# Altium schematic sheet ESP32S3.SchDoc
size A3; SheetNumber: 1; SheetTotal: 1
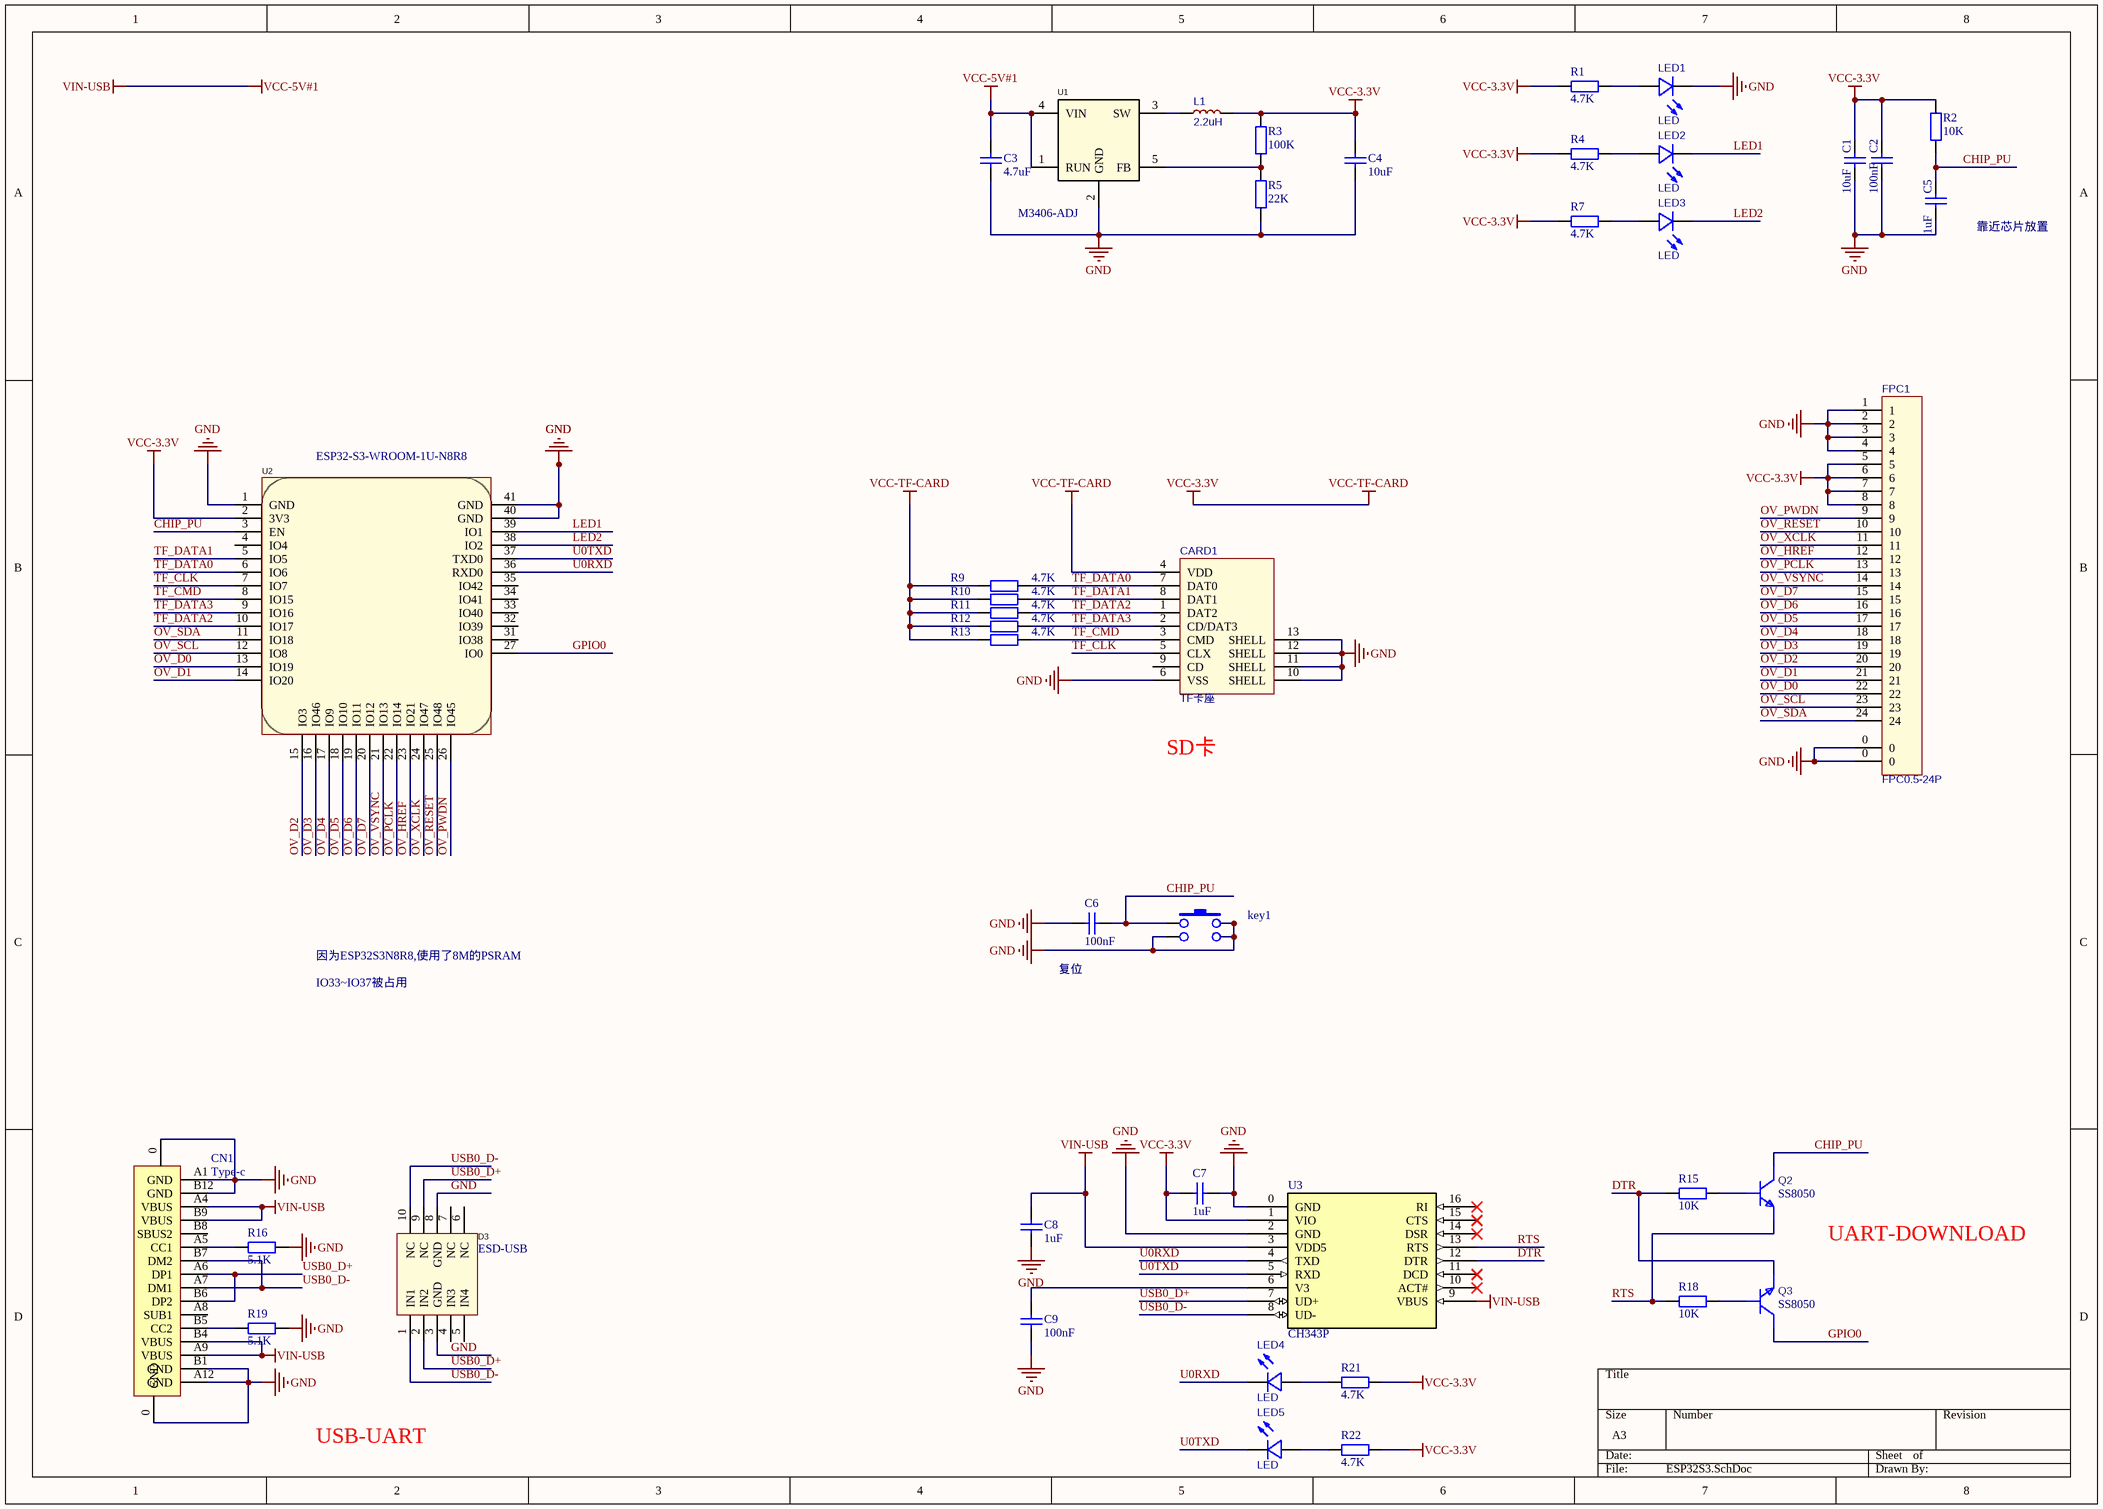
[diagram p0: ESP32S3.SchDoc]

## Parts
C1  10uF  [0603-C]
C2  100nF  [0603-C]
C3  4.7uF  [0603-C]
C4  10uF  [0603-C]
C5  1uF  [0603-C]
C6  100nF  [0603-C]
C7  1uF  [0603-C]
C8  1uF  [0603-C]
C9  100nF  [0603-C]
CARD1  TF卡座  [TF]
CN1  Type-c  [Type-c 16pin]
D3  ESD-USB  [SLP2510P8]
FPC1  FPC0.5-24P  [FPC-SMD_P0.50-24P_XJ-FGS]
key1  KEY  [轻触开关侧按3*6*3.5]  (value not drawn)
L1  2.2uH  [电感 4.2X4.4]
LED1  LED  [LED-0603]
LED2  LED  [LED-0603]
LED3  LED  [LED-0603]
LED4  LED  [LED-0603]
LED5  LED  [LED-0603]
Q2  SS8050  [SOT23-3M]
Q3  SS8050  [SOT23-3M]
R1  4.7K  [0603-R]
R2  10K  [0603-R]
R3  100K  [0603-R]
R4  4.7K  [0603-R]
R5  22K  [0603-R]
R7  4.7K  [0603-R]
R9  4.7K  [0603-R]
R10  4.7K  [0603-R]
R11  4.7K  [0603-R]
R12  4.7K  [0603-R]
R13  4.7K  [0603-R]
R15  10K  [0603-R]
R16  5.1K  [0603-R]
R18  10K  [0603-R]
R19  5.1K  [0603-R]
R21  4.7K  [0603-R]
R22  4.7K  [0603-R]
U1  M3406-ADJ  [M3406-ADJ]
U2  ESP32-S3-WROOM-1U-N8R8  [WIRELM-SMD_ESP32-S3-WROOM-1U]
U3  CH343P  [QFN16_3X3]

## Nets
GND: C1.1 C2.2 C3.1 C4.1 C5.2 C6.2 C7.2 C8.2 C9.2 CARD1.6(VSS) CARD1.10(SHELL) CARD1.11(SHELL) CARD1.12(SHELL) CARD1.13(SHELL) CN1.0(GND) CN1.A1(GND) CN1.A12(GND) CN1.B1(GND) CN1.B12(GND) D3.3(GND) D3.8(GND) FPC1.0 FPC1.1 FPC1.2 FPC1.3 FPC1.4 key1.2 key1.3 key1.4 LED1.1(-) R5.2 R16.2 R19.2 U1.2(GND) U2.1(GND) U2.40(GND) U2.41(GND) U3.0(GND) U3.2(GND)
VCC-3.3V: C1.2 C2.1 C4.2 C7.1 CARD1.4(VDD) FPC1.5 FPC1.6 FPC1.7 FPC1.8 L1.2 R1.1 R2.2 R3.2 R4.1 R7.1 R9.1 R10.1 R11.1 R12.1 R13.1 R21.1 R22.1 U2.2(3V3) U3.1(VIO)  [also labelled VCC-TF-CARD]
VCC-5V#1: C3.2 C8.1 CN1.A4(VBUS) CN1.A9(VBUS) CN1.B4(VBUS) CN1.B9(VBUS) U1.1(RUN) U1.4(VIN) U3.3(VDD5) U3.9(VBUS)  [also labelled VIN-USB]
CHIP_PU: C5.1 C6.1 key1.1 Q2.3(C) R2.1 U2.3(EN)
DTR: Q3.2(E) R15.1 U3.12(DTR)
GPIO0: Q3.3(C) U2.27(IO0)
LED1: LED2.1(-) U2.39(IO1)
LED2: LED3.1(-) U2.38(IO2)
OV_D0: FPC1.22 U2.13(IO19)
OV_D1: FPC1.21 U2.14(IO20)
OV_D2: FPC1.20 U2.15(IO3)
OV_D3: FPC1.19 U2.16(IO46)
OV_D4: FPC1.18 U2.17(IO9)
OV_D5: FPC1.17 U2.18(IO10)
OV_D6: FPC1.16 U2.19(IO11)
OV_D7: FPC1.15 U2.20(IO12)
OV_HREF: FPC1.12 U2.23(IO21)
OV_PCLK: FPC1.13 U2.22(IO14)
OV_PWDN: FPC1.9 U2.26(IO45)
OV_RESET: FPC1.10 U2.25(IO48)
OV_SCL: FPC1.23 U2.12(IO8)
OV_SDA: FPC1.24 U2.11(IO18)
OV_VSYNC: FPC1.14 U2.21(IO13)
OV_XCLK: FPC1.11 U2.24(IO47)
RTS: Q2.2(E) R18.1 U3.13(RTS)
TF_CLK: CARD1.5(CLX) U2.7(IO7)
TF_CMD: CARD1.3(CMD) R13.2 U2.8(IO15)
TF_DATA0: CARD1.7(DAT0) R9.2 U2.6(IO6)
TF_DATA1: CARD1.8(DAT1) R10.2 U2.5(IO5)
TF_DATA2: CARD1.1(DAT2) R11.2 U2.10(IO17)
TF_DATA3: CARD1.2(CD/DAT3) R12.2 U2.9(IO16)
U0RXD: LED4.1(-) U2.36(RXD0) U3.4(TXD)
U0TXD: LED5.1(-) U2.37(TXD0) U3.5(RXD)
USB0_D+: CN1.A6(DP1) CN1.B6(DP2) D3.2(IN2) D3.9(NC) U3.7(UD+)
USB0_D-: CN1.A7(DM1) CN1.B7(DM2) D3.1(IN1) D3.10(NC) U3.8(UD-)
NetC9_1: C9.1 U3.6(V3)
NetCN1_A5: CN1.A5(CC1) R16.1
NetCN1_B5: CN1.B5(CC2) R19.1
NetL1_1: L1.1 U1.3(SW)
NetLED1_2: LED1.2(+) R1.2
NetLED2_2: LED2.2(+) R4.2
NetLED3_2: LED3.2(+) R7.2
NetLED4_2: LED4.2(+) R21.2
NetLED5_2: LED5.2(+) R22.2
NetQ2_1: Q2.1(B) R15.2
NetQ3_1: Q3.1(B) R18.2
NetR3_1: R3.1 R5.1 U1.5(FB)

Not connected (* = marked no-connect by the designer): CARD1 9(CD); CN1 A8(SUB1) B8(SBUS2); D3 4(IN3) 5(IN4) 6(NC) 7(NC); U2 4(IO4) 31(IO38) 32(IO39) 33(IO40) 34(IO41) 35(IO42); U3 10(ACT#)* 11(DCD)* 14(DSR)* 15(CTS)* 16(RI)*

## Notes on the sheet
- (near C5) 靠近芯片放置
- SD卡
- 因为ESP32S3N8R8,使用了8M的PSRAM
- IO33~IO37被占用
- (near C6) 复位
- UART-DOWNLOAD
- USB-UART

## Library data of the parts
C1-C9 = C: 贴片电容; BOM名称: 无极性贴片电容; 联系卖家，免费查找封装: 唯一出售店铺网址https://shop463601444.taobao.com
CARD1 = TF卡座: BOM_Manufacturer: THD; BOM_Manufacturer Part: THD2528-11SD-GF; Contributor: LCSC; BOM_Supplier: LCSC; BOM_Supplier Part: C283232; BOM_JLCPCB Part Class: Extended Part; spicePre: C; spiceSymbolName: THD2528-11SD-GF
CN1 = Type-c: U262-161N-4BVC11
D3 = ESD-USB: RClamp0524PATCT; Manufacturer: SEMTECH; Device: RClamp0524PATCT_C40960; Add into BOM: yes; Reverse Stand-Off Voltage (Vrwm): 5V; Breakdown Voltage (VBR): 6V; Clamping Voltage@Ipp: 15V; Peak Pulse Power(Ppp)@8/20us: 150W; Junction Capacitance(Cj)@1MHz: 0.8pF@1MHz; Name: RClamp0524PATCT; Symbol: RClamp0524PATCT; LCSC Part Name: RClamp0524PATCT; Supplier Part: C40960; Manufacturer Part: RClamp0524PATCT; Supplier Footprint: SLP2510P8; JLCPCB Part Class: Extended Part; Datasheet: https://atta.szlcsc.com/upload/public/pdf/source/20150124/1457707260739.pdf; Supplier: LCSC; Convert to PCB: yes; Operating Temperature: -55℃~+125℃@(Tj)
FPC1 = FPC0.5-24P: BOM_Manufacturer: Shenzhen Cankemeng; Contributor: LCSC; BOM_Supplier: LCSC; BOM_Supplier Part: C132514; BOM_Manufacturer Part: -; BOM_JLCPCB Part Class: Extended Part; spicePre: F; spiceSymbolName: FPC0.5-24P
key1 = 轻触开关3*6*3.6
L1 = L: BOM_Manufacturer: Sunlord; BOM_Manufacturer Part: UPZ2012D800-4R0TF; nameAlias: Value; Contributor: LCSC; BOM_Supplier: LCSC; BOM_Supplier Part: C145060; BOM_JLCPCB Part Class: Extended Part; spicePre: L; spiceSymbolName: UPZ2012D800-4R0TF
LED1-LED5 = LED: BOM_Manufacturer: Wuxi ARK Tech Elec; BOM_Manufacturer Part: D-G060306G1-KS2; Contributor: LCSC; BOM_Supplier: LCSC; BOM_Supplier Part: C118334; BOM_JLCPCB Part Class: Extended Part; spicePre: L; spiceSymbolName: D-G060306G1-KS2
R1-R5 R7 R9-R13 R15 R16 R18 R19 R21 R22 = R: 贴片电阻; 联系卖家，免费查找封装: 唯一出售店铺网址https://shop463601444.taobao.com; BOM名称: 贴片电阻
U1 = M3406-ADJ: Manufacturer: 西安航天民芯; Symbol: M3406; Add into BOM: yes; Function: 降压型; Name: M3406-ADJ; Device: M3406-ADJ; LCSC Part Name: 降压型; Supplier Part: C83224; Manufacturer Part: M3406-ADJ; Supplier Footprint: SOT-23-5; JLCPCB Part Class: Extended Part; Datasheet: https://atta.szlcsc.com/upload/public/pdf/source/20161110/1478742836232.pdf; Supplier: LCSC; Convert to PCB: yes; Synchronous Rectification: -; Number of Outputs: -; Topology: -; Input Voltage: -; Output Current (Max): -; Switching Frequency: -
U2 = ESP32-S3-WROOM-1U-N8R8: Manufacturer: ESPRESSIF(乐鑫); Add into BOM: yes; Name: ESP32-S3-WROOM-1U-N8; Symbol: ESP32-S3-WROOM-1U-N8; Device: ESP32-S3-WROOM-1U-N8; LCSC Part Name: ESP32-S3-WROOM-1U-N8; Supplier Part: C2980297; Manufacturer Part: ESP32-S3-WROOM-1U-N8; Supplier Footprint: SMD; JLCPCB Part Class: Extended Part; Datasheet: https://atta.szlcsc.com/upload/public/pdf/source/20220628/A2AC12B3C87735CAEB7EBE2DBE80936C.pdf; Supplier: LCSC; Convert to PCB: yes
U3 = CH343P: USB to high speed enhanced TTL Serial / UART